# Altium schematic sheet Pressure sensor.SchDoc
size A3; SheetNumber: 11; SheetTotal: 12
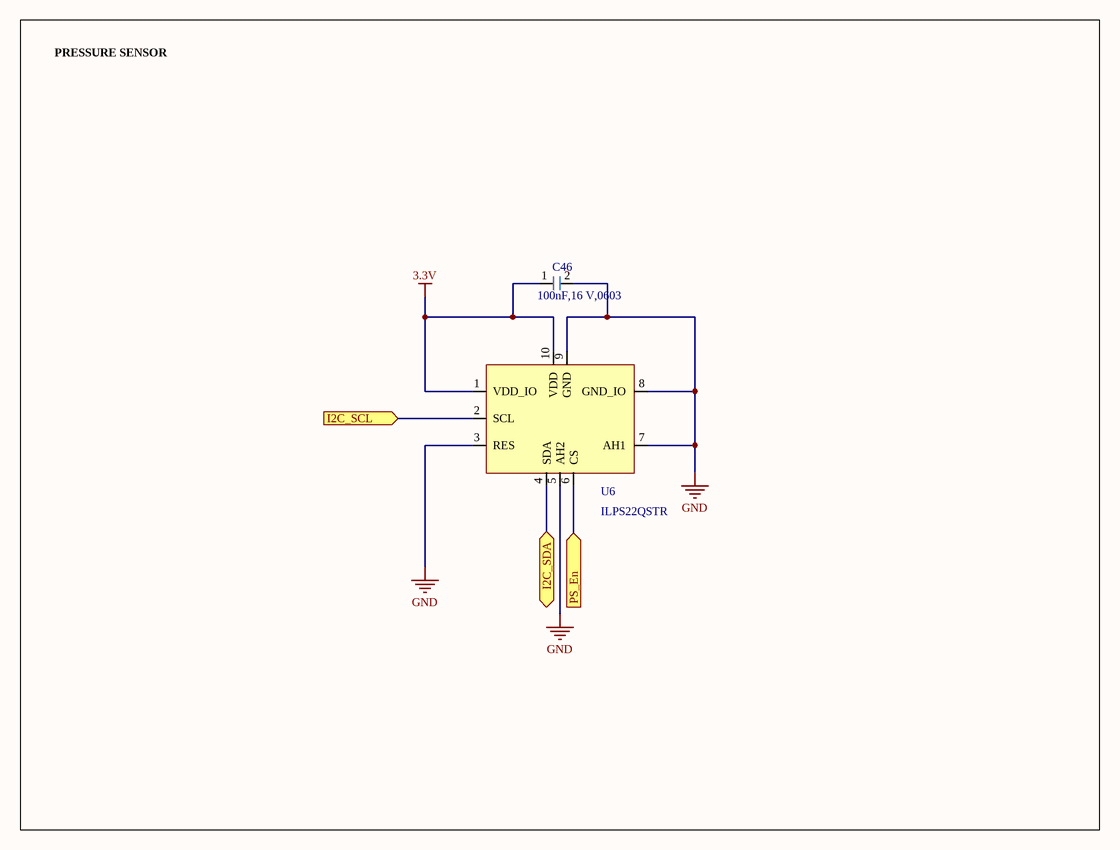
[diagram p0: Pressure sensor.SchDoc]

## Parts
C46  Value Display: 100nF,16 V,0603  [CAPC1608X05N 0603]  (hidden comment: CC0603KRX7R7BB104)
U6  ILPS22QSTR  [QFN50P200X200X80-10N]

## Blocks framed on the sheet
PRESSURE SENSOR: C46 U6

## Ports
I2C_SCL (in), I2C_SDA (bidir), PS_En (in)

## Nets
3.3V: C46.1 U6.1(VDD_IO) U6.10(VDD)
GND: C46.2 U6.3(RES) U6.5(AH2) U6.7(AH1) U6.8(GND_IO) U6.9(GND)
I2C_SCL: U6.2(SCL) ; port I2C_SCL
I2C_SDA: U6.4(SDA) ; port I2C_SDA
PS_En: U6.6(CS) ; port PS_En

## Library data of the parts
C46 = Cap_CC0603KRX7R7BB104: Multilayer Ceramic Capacitor, 100 nF, 16V, ±10%,  X7R 0603 [1608 Metric]; Manufacturer: Yageo; Value: 100nF; Max Temp: 125 degC; Min Temp: -55 degC; Polarized: No; AEC-Q: NA; Manufacturer Part Number: CC0603KRX7R7BB104; Category: Capacitor; ComponentLink1Description: Datasheet; Mount Type: Surface Mount; Package: 0603; RoHS: Yes; Supplier 1: Digikey; Supplier 1 Part Number: 311-1088-1-ND; Supplier 1 pricing per Unit: 8.34 INR; Supplier: Mouser; Supplier Part Number: 603-CC603KRX7R7BB104; Supplier pricing per Unit: 8.34 INR; Technology: Ceramic; Temp Coefficient: X7R; Tolerance: 10%; Value 1: CC0603KRX7R7BB104; Voltage: 16V; ComponentLink1URL: https://www.yageo.com/upload/media/product/productsearch/datasheet/mlcc/UPY-GPHC_X7R_6.3V-to-250V_24.pdf
U6 = IC_ILPS22QSTR: Pressure Sensor 3.77PSI ~ 58.89PSI (26kPa ~ 406kPa) Absolute 24 b 10-WFLGA; Manufacturer: ST; AEC-Q: NA; Max Temp: 105 degC; Min Temp: -40 degC; Value: 3.3V - 50uA; Voltage: 3.3V; Category: Pressure Sensor; ComponentLink1Description: Datasheet; ComponentLink1URL: https://www.st.com/resource/en/datasheet/ilps22qs.pdf; Manufacturer Part Number: ILPS22QSTR; Mount Type: Surface Mount; Package: HLGA; RoHS: Yes; Supplier 1: Digikey; Supplier 1 Part Number: 497-ILPS22QSTRCT-ND; Supplier 1 pricing per Unit: 377.56 INR; Supplier: Mouser; Supplier Part Number: 511-ILPS22QSTR; Supplier pricing per Unit: 395.35 INR; Value 1: ILPS22QSTR; Value Display: 3.3V - 50uA